# EAGLE design Unregulated DC Power Supply (EAGLE 6.3)
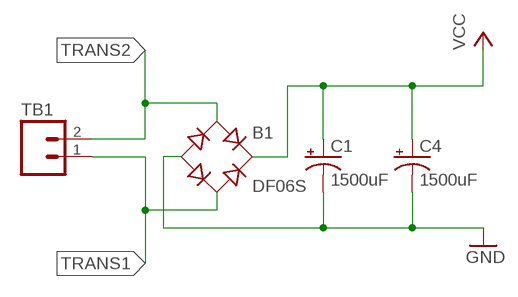
[diagram p0: schematic, sheet 1]

## Parts
B1  DF06S  [DFS]
C1  1500uF  CAP_POL_J16  [CAP_J16]
C4  1500uF  CAP_POL_J16  [CAP_J16]
TB1  TERMINAL_BLOCK_2  [TERMINL_BLOCK_2_POS]

## Nets
GND: B1.- C1.1(-) C4.1(-)
TRANS1: B1.AC2 TB1.1
TRANS2: B1.AC1 TB1.2
VCC: B1.+ C1.2(+) C4.2(+)

## Library data of the parts
B1 = rectifier:DF*S: Surface Mount Glass Passivated Bridge Rectifiers Source: Source: Comchip Bridge Rectifiers DF005S-G thru DF10S-G.pdf
C1 C4 = jkf-parts:CAP_POL_J16: POL J16 SMT CAP
TB1 = jkf-parts:TERMINAL_BLOCK_2: Terminal Block 2 position

## Net classes
0 default: clearance 0.254 mm

## Board
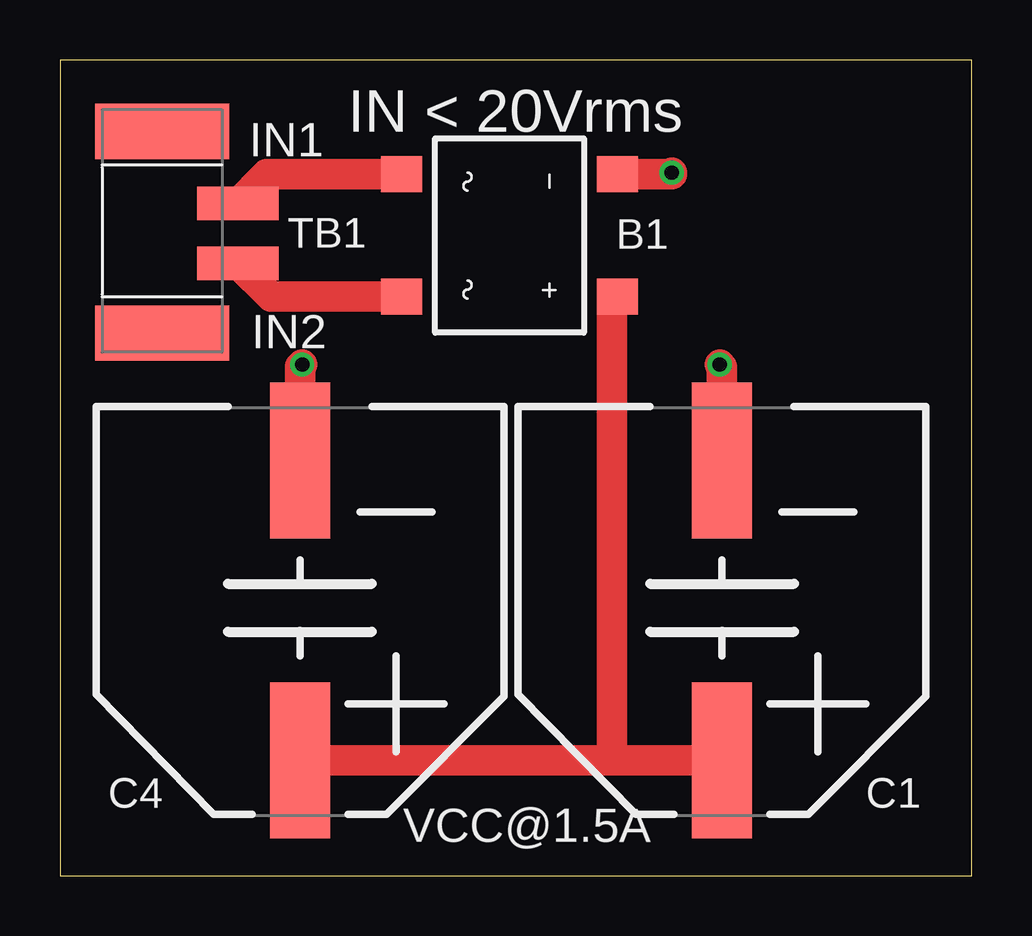
[diagram p1: board, top side]
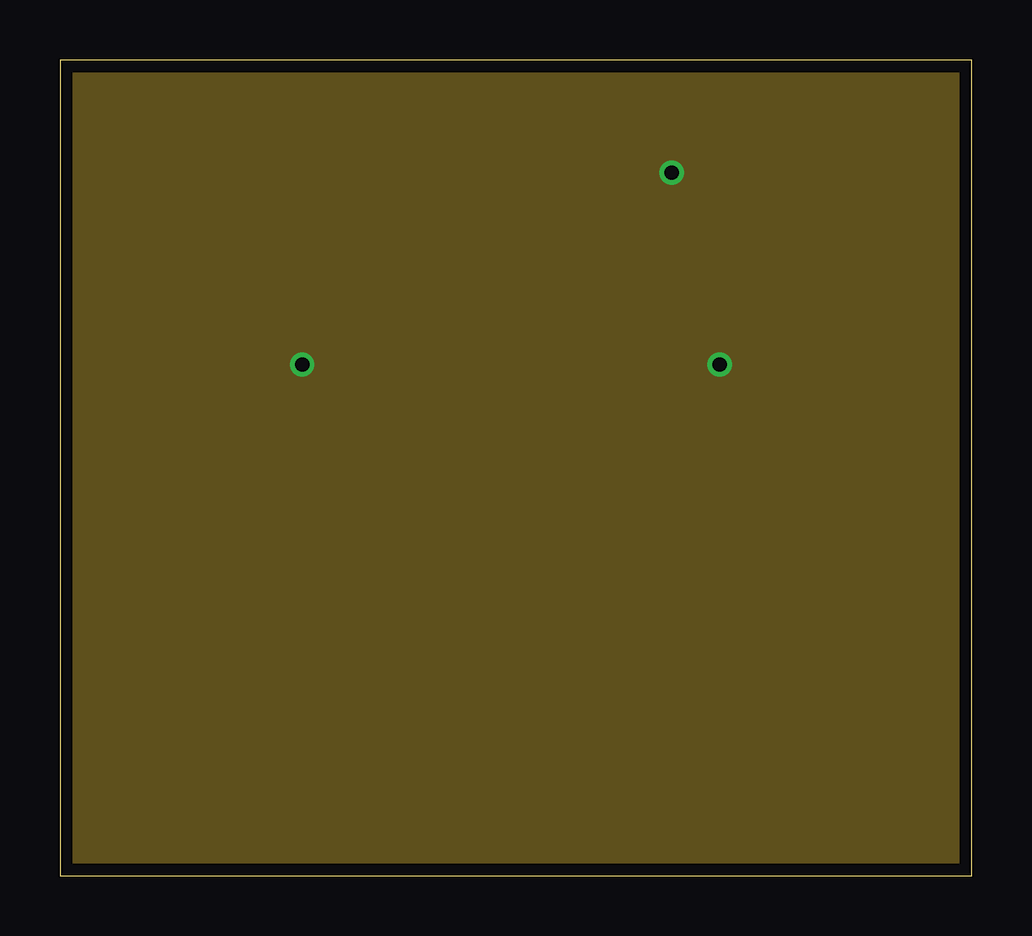
[diagram p2: board, inner layer Route2]
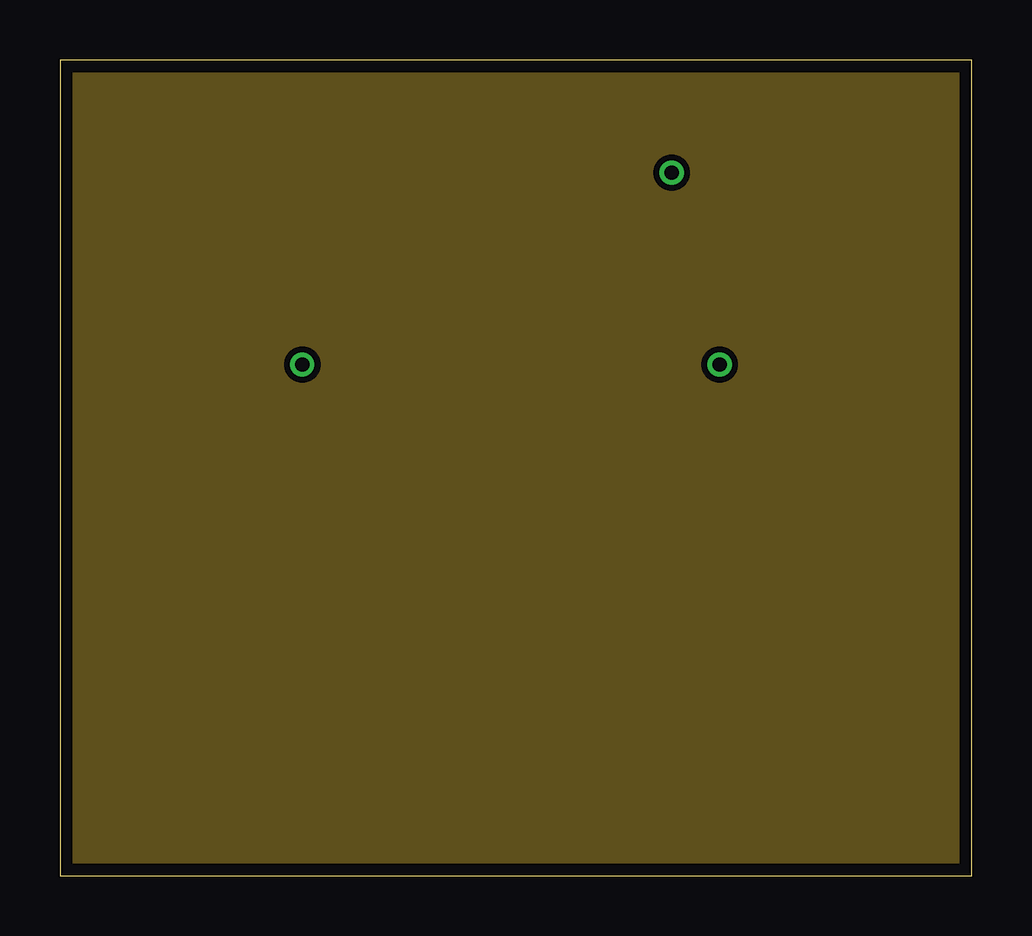
[diagram p3: board, inner layer Route15]

Size 38 x 34 mm. Coordinates in mm from the lower left corner, seen from the top.
Outline: 0,0 38,0 38,34 0,34 0,0
Copper layers (1+2*15+16): Top 0.0178mm / dielectric 12mil / Route2 0.0356mm / dielectric 28mil / Route15 0.0356mm / dielectric 12mil / Bottom 0.0178mm
Design rules "SSC-EAGLE-4Lyr_v1.0.0.3": minimum track width 6mil, minimum drill 8mil, track to track 6mil, track to pad 6mil, pad to pad 6mil, via to via 6mil, smd to smd 6mil, copper to edge 20mil, drill to drill 16mil, minimum pad ring 8mil, minimum via ring 8mil, stop-mask expansion 3mil, vias tented up to drill 0mil, thermal gap 10mil

### Footprints (pad centres in the part's own frame; a part is rotated, then mirrored left to right if it is on the bottom)
DFS = smd 1.5 x 1.7: + -2.55,-4.5; - 2.55,-4.5; AC1 -2.55,4.5; AC2 2.55,4.5
CAP_J16 = smd 2.5 x 6.5: 1 0,6.15; 2 0,-6.35
TERMINL_BLOCK_2_POS = smd 1.4 x 3.4: 1 -1,3.15; 2 1.5,3.15 | smd 2.3 x 5.6: P$1 -4,0; P$2 4.4,0

### Placement (x,y rotation side)
B1  18.74,26.68 90 top
C1  27.6,11.16 0 top
C4  10.01,11.16 0 top
TB1  4.26,27.02 270 top

### Tracks (layer width: path | path; a pad name or v marks a point on that pad's centre or on a via)
3.3V
  pour Route15: 0,34 38,34 38,0 0,0
GND  (via drill 0.6)
  Top 1.27: C4.1 10.01,21.21 v10.1,21.3 | C1.1 27.6,21.2 v27.5,21.3 | B1.- 25.5,29.23 v25.5,29.3
  pour Route2: 0,34 38,34 38,0 0,0
TRANS1
  Top 1.27: TB1.1 8.62,29.23 B1.AC2
TRANS2
  Top 1.27: TB1.2 8.8,24.13 B1.AC1
VCC
  Top 1.27: C4.2 23,4.81 | 23,4.81 C1.2 | B1.+ 23,24.13 23,4.81

### Text on the board
tPlace: IN1 | IN < 20Vrms | IN2 | VCC@1.5A